# EAGLE design Crowtail- A6 GPRS GSM Module v1.0 (EAGLE 6.3)
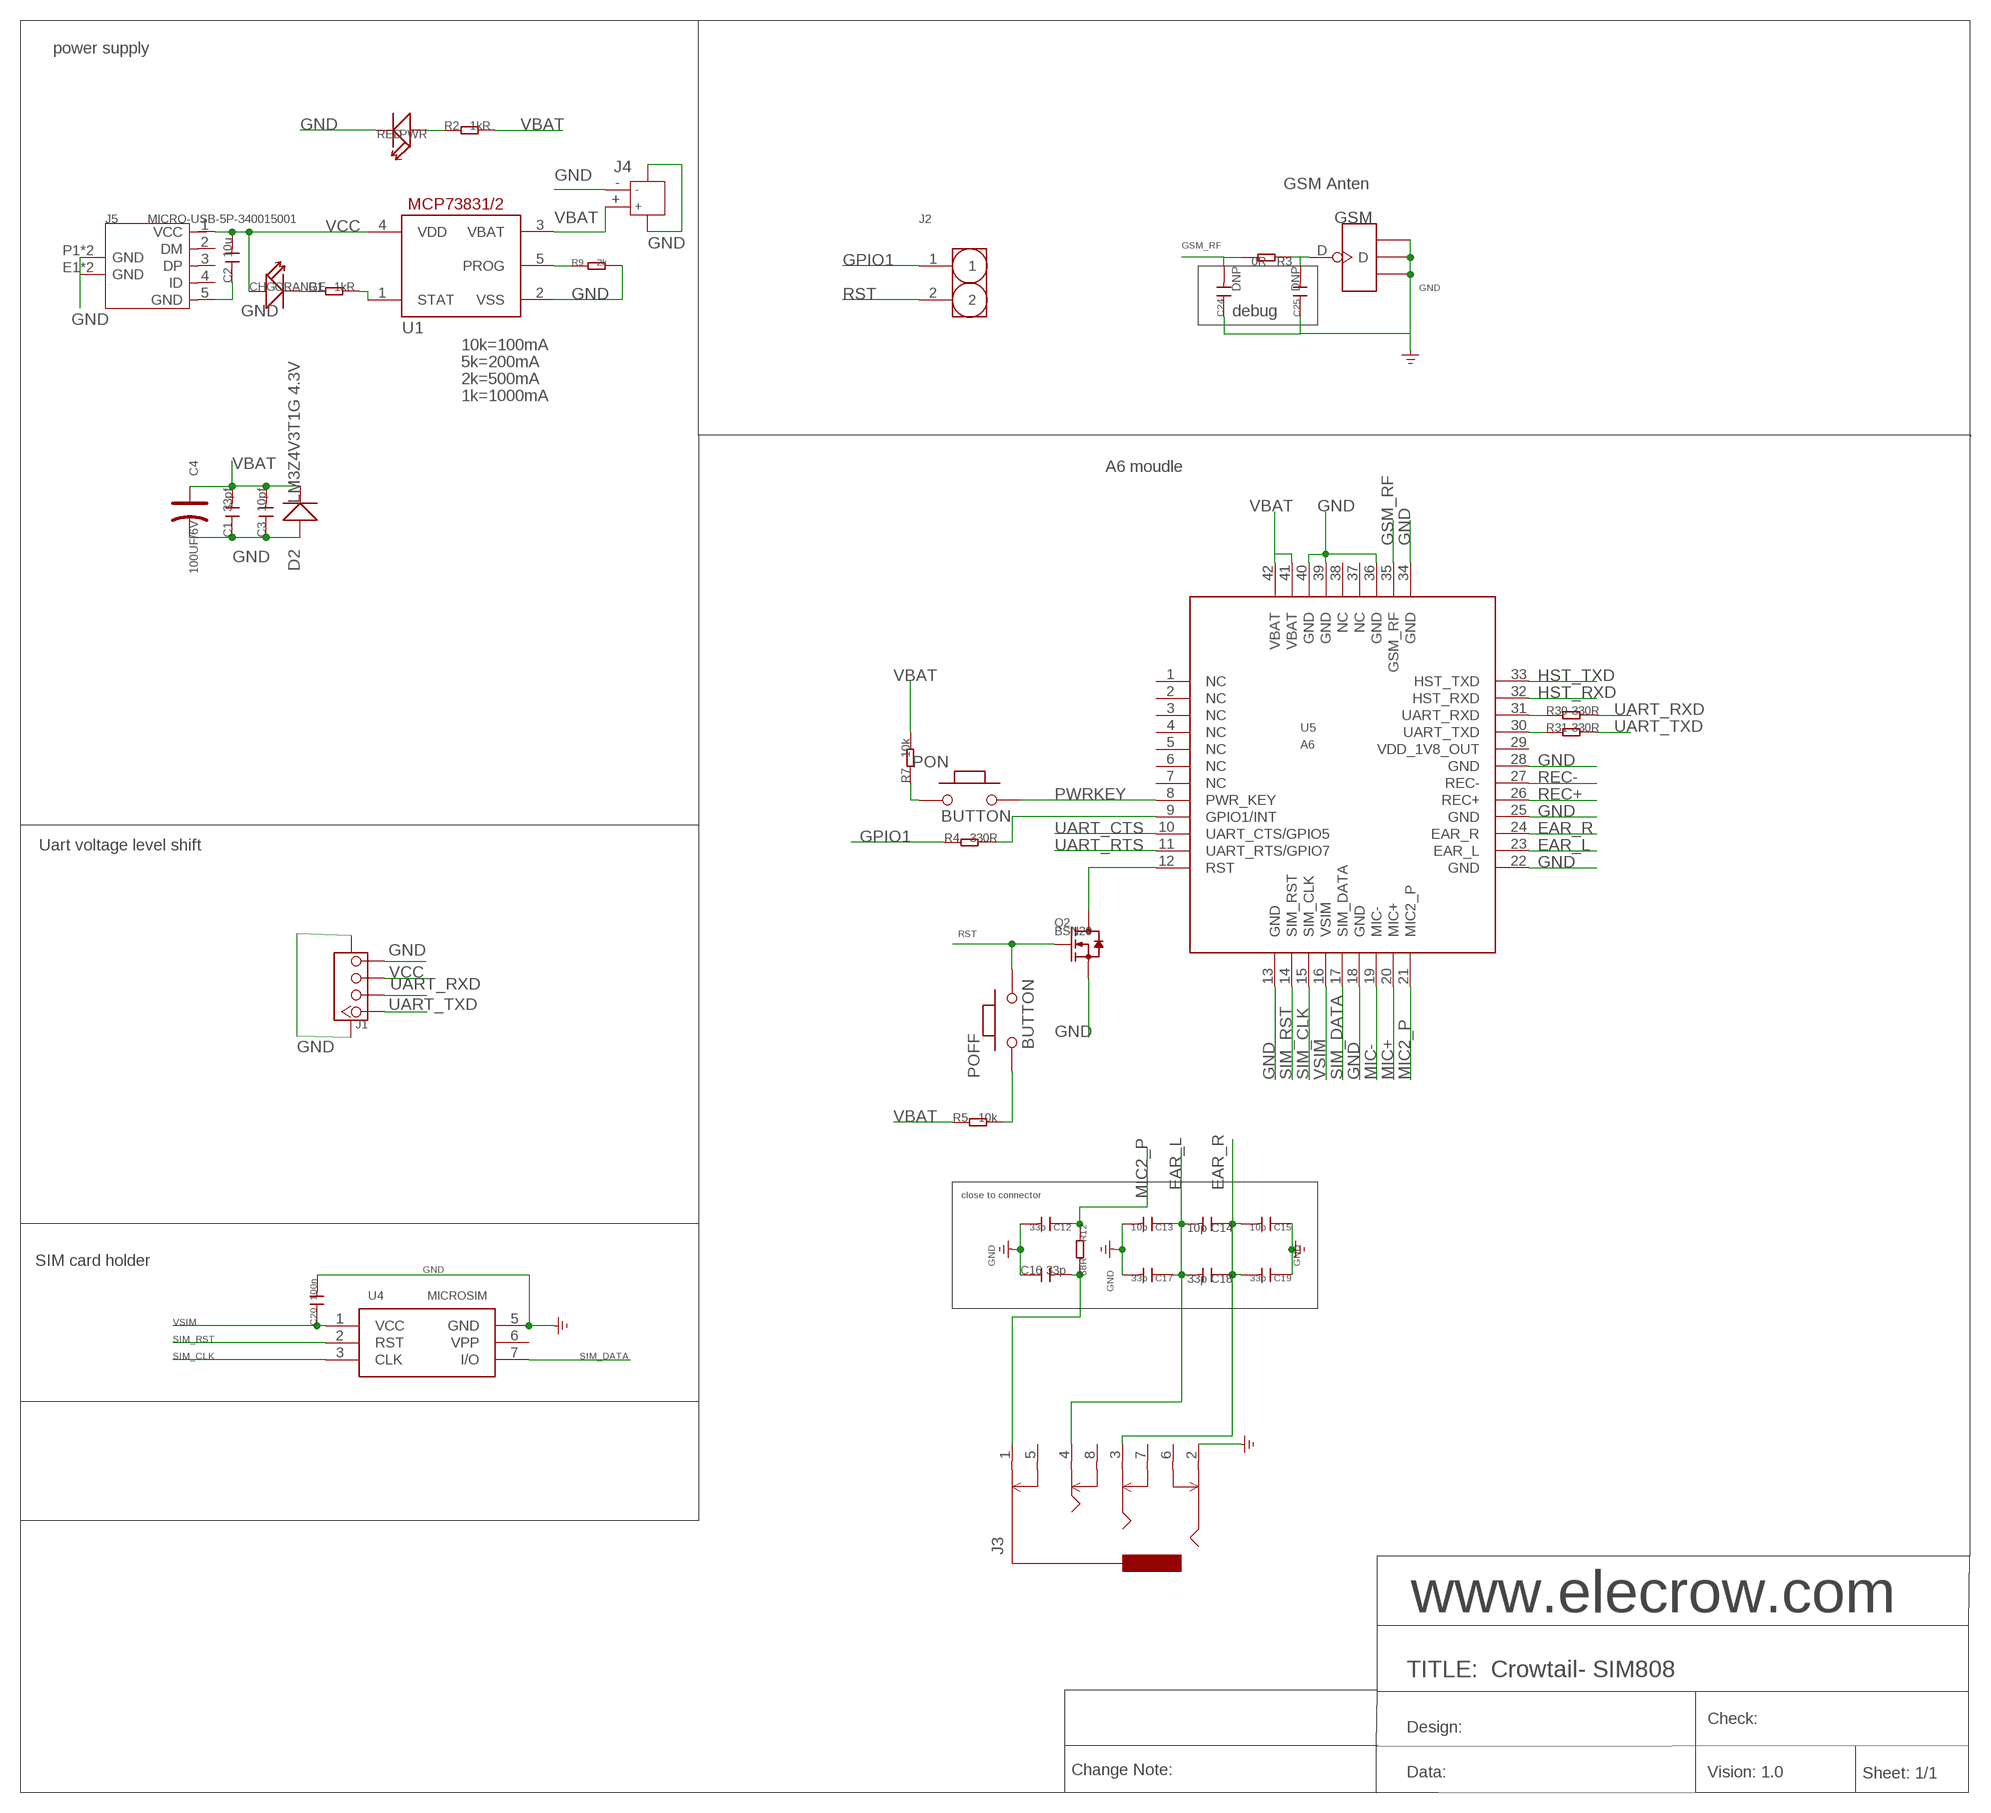
[diagram p0: schematic, sheet 1]

## Parts
C1  33pf  C-0603  [C0603]
C2  10u  C-0603  [C0603]
C3  10pf  C-0603  [C0603]
C4  100UF/6V  CAP-AVX-A  [AVX-A]
C12  33p  C-0603  [C0603]
C13  10p  C-0402  [C0402]
C14  10p  C-0402  [C0402]
C15  10p  C-0402  [C0402]
C16  33p  C-0603  [C0603]
C17  33p  C-0402  [C0402]
C18  33p  C-0402  [C0402]
C19  33p  C-0402  [C0402]
C20  100n  C-0603  [C0603]
C24  DNP  C-0402  [C0402]
C25  DNP  C-0402  [C0402]
CHG  ORANGE  007-LED0603  [D0603]
D2  LM3Z4V3T1G 4.3V  D'0805'  [SOD323]
GSM  ANTENNA-U-FL  [4P-U-FL]
J1  TWIG-4P-2.0-SMD-FEMALE-REINFORCE'90D'  [4P-SMD-2.0-90D]
J2  HEADER-2P-65/35MIL  [2P-2.54-65/35MIL]
J3  AUDIO-8P'PJ-3536-L6S'  [8P-3.5-SMD]
J4  JACK-JST-2P-SMD-PW'2.0'  [JST-SMD-2.0-90D]
J5  MICRO-USB-5P-340015001  [B-SMD-5P]
POFF  BUTTON  PB157  [157SW]
PON  BUTTON  PB157  [157SW]
PWR  RED  007-LED0603  [D0603]
Q2  BSN20  MOSFET-N'SOT23'  [SOT23]
R1  1kR  R-0603  [R0603]
R2  1kR  R-0603  [R0603]
R3  0R  R-0603  [R0603]
R4  330R  R-0603  [R0603]
R5  10k  R-0603  [R0603]
R7  10k  R-0603  [R0603]
R9  2k  R-0603  [R0603]
R12  68R  R-0603  [R0603]
R30  330R  R-0603  [R0603]
R31  330R  R-0603  [R0603]
U1  MCP73831/OT  [SOT23-5L]
U4  MICROSIM  [MICROSIM]
U5  A6  [A6]

## Nets
EAR_L: C13.1 C14.2 C17.1 C18.2 J3.4 U5.23(EAR_L)
EAR_R: C14.1 C15.2 C18.1 C19.2 J3.3 U5.24(EAR_R)
GND: C1.1 C2.1 C3.1 C4.- C12.2 C13.2 C15.1 C16.1 C17.2 C19.1 C20.2 C24.1 C25.1 D2.+ GSM.GND1 GSM.GND2 GSM.GND3 J1.4 J1.SS1 J1.SS2 J3.2 J4.3 J4.4 J4.- J5.5(GND) J5.E1(GND) J5.E2(GND) J5.P1(GND) J5.P2(GND) PWR.- Q2.2(S) R9.2 U1.2(VSS) U4.5(GND) U5.13(GND) U5.18(GND) U5.22(GND) U5.25(GND) U5.28(GND) U5.34(GND) U5.36(GND) U5.39(GND) U5.40(GND)
GPIO1: J2.1 R4.1
GSM_RF: C24.2 R3.2 U5.35(GSM_RF)
HST_RXD: U5.32(HST_RXD)
HST_TXD: U5.33(HST_TXD)
MIC2_P: C12.1 R12.1 U5.21(MIC2_P)
MIC+: U5.20(MIC+)
MIC-: U5.19(MIC-)
N$1: POFF.1 R5.2
N$5: C25.2 GSM.D R3.1
N$6: PWR.+ R2.1
N$7: R30.1 U5.31(UART_RXD)
N$8: R31.1 U5.30(UART_TXD)
N$9: PON.1 R7.1
N$11: CHG.- R1.1
N$12: Q2.3(D) U5.12(RST)
N$13: R4.2 U5.9(GPIO1/INT)
N$20: R1.2 U1.1(STAT)
N$30: C16.2 J3.1 R12.2
N$31: R9.1 U1.5(PROG)
PWRKEY: PON.2 U5.8(PWR_KEY)
REC+: U5.26(REC+)
REC-: U5.27(REC-)
RST: J2.2 POFF.2 Q2.1(G)
SIM_CLK: U4.3(CLK) U5.15(SIM_CLK)
SIM_DATA: U4.7(I/O) U5.17(SIM_DATA)
SIM_RST: U4.2(RST) U5.14(SIM_RST)
UART_CTS: U5.10(UART_CTS/GPIO5)
UART_RTS: U5.11(UART_RTS/GPIO7)
UART_RXD: J1.2 R30.2
UART_TXD: J1.1 R31.2
VBAT: C1.2 C3.2 C4.+ D2.- J4.+ R2.2 R5.1 R7.2 U1.3(VBAT) U5.41(VBAT) U5.42(VBAT)
VCC: C2.2 CHG.+ J1.3 J5.1(VCC) U1.4(VDD)
VSIM: C20.1 U4.1(VCC) U5.16(VSIM)
Unconnected: J3.5 J3.6 J3.7 J3.8 J5.2(DM) J5.3(DP) J5.4(ID) U4.6(VPP) U5.1(NC) U5.2(NC) U5.3(NC) U5.4(NC) U5.5(NC) U5.6(NC) U5.7(NC) U5.29(VDD_1V8_OUT) U5.37(NC) U5.38(NC)

## Notes on the sheet
- power supply
- GSM Anten
- debug
- 10k=100mA
- 5k=200mA
- 2k=500mA
- 1k=1000mA
- A6 moudle
- Uart voltage level shift
- close to connector
- SIM card holder
- www.elecrow.com
- TITLE:  Crowtail- SIM808
- Check:
- Design:
- Change Note: | Data: | Vision: 1.0 | Sheet: 1/1

## Library data of the parts
C1-C3 C12-C20 C24 C25 = Discrete:C*: Ceramic Capacitors
C4 = Discrete:CAP*: Electrolytic Capacitors,Tantalum Capacitors and Super Capacitors
CHG PWR = Discrete:007-LED*
D2 = Discrete:D*
GSM = Connector:ANTENNA-U-FL
J1 = Connector:TWIG-4P-2.0-SMD-FEMALE-REINFORCE
J2 = Connector:HEADER-2P
J3 = template:AUDIO-8P
J4 = Connector:JACK-JST-2P-SMD-PW
J5 = OPL Eagle Library:MICRO-USB-5P: ST-USB-001E：MICRO USB B SMD R/A
POFF PON = MySMD:PB157
Q2 = Discrete:MOSFET-N: IRLL014: http://www.vishay.com/docs/91319/sihll014.pdf
R1-R5 R7 R9 R12 R30 R31 = Discrete:R*
U1 = adafruit:MCP73831: MCP73831/2 Miniature Single-Cell, Fully Integrated Li-Ion, Li-Polymer Charge Management Controllers. Nice and small simple lipoly charge controller, with adjustable current and status output (LED) http://www.ladyada.net/library/pcb/eaglelibrary.html
U4 = Connector:MICROSIM
U5 = IC:A6

## Net classes
0 default: width 0.152 mm, drill 0.152 mm, clearance 0.152 mm

## Board
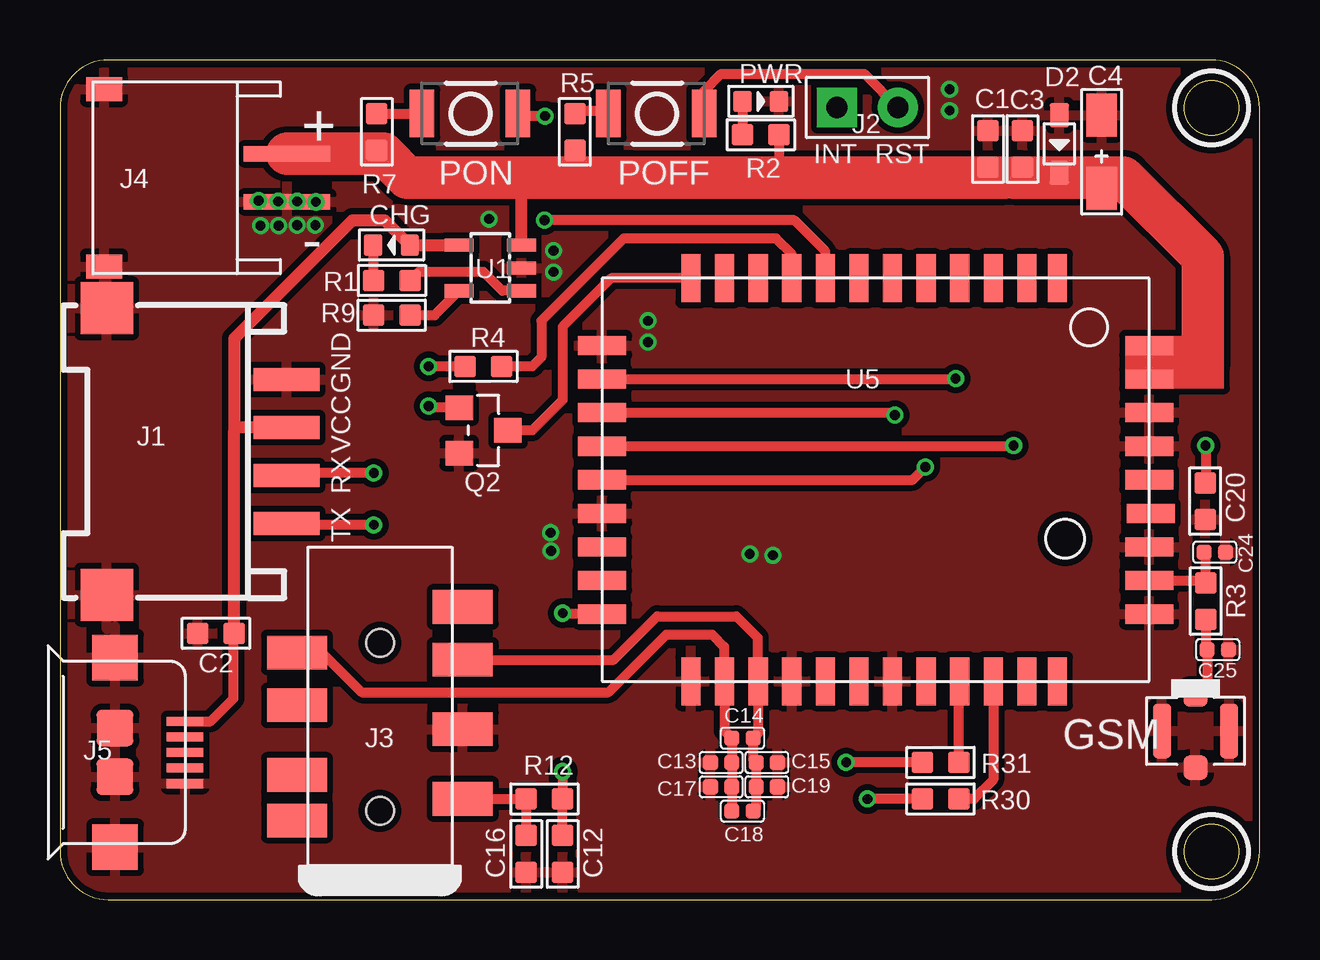
[diagram p1: board, top side]
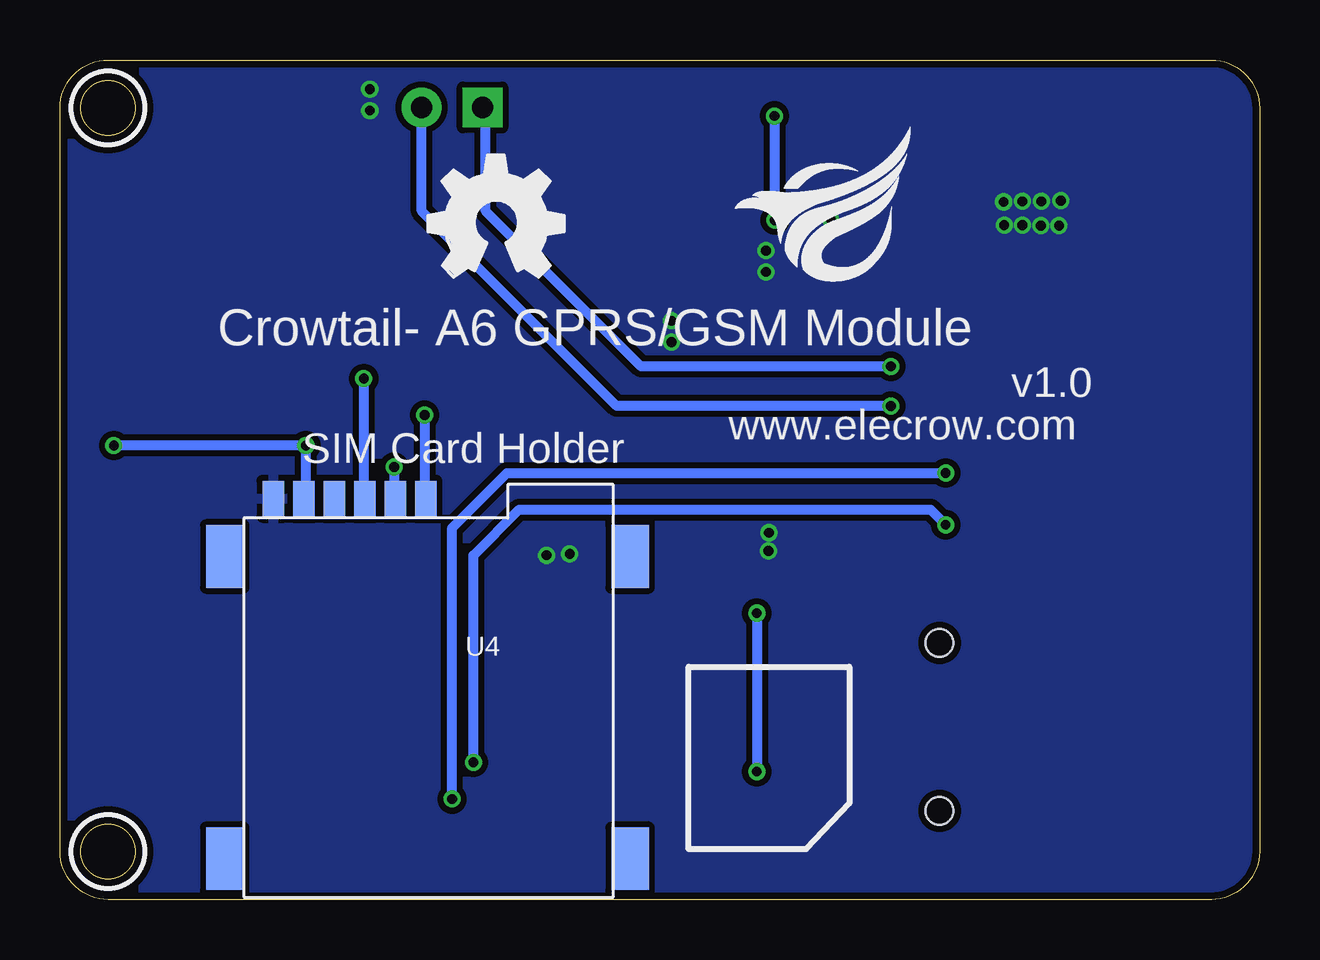
[diagram p2: board, bottom side, seen from below]

Size 50 x 35 mm. Coordinates in mm from the lower left corner, seen from the top.
Outline: 0,33 0,2 arc90 2,0 48,0 arc90 50,2 50,33 arc90 48,35 2,35 arc90 0,33
Outline: circle at 48,2 radius 1.14
Outline: circle at 48,33 radius 1.14
Copper layers (1*16): Top 0.035mm / dielectric 1.5mm / Bottom 0.035mm
Design rules "default": minimum track width 6mil, minimum drill 12mil, track to track 10mil, track to pad 10mil, pad to pad 10mil, via to via 6mil, smd to smd 0mil, copper to edge 12mil, drill to drill 12mil, minimum pad ring 10mil, minimum via ring 6mil, stop-mask expansion 2mil, vias tented up to drill 100mil, thermal gap 10mil
tRestrict: area 35.6,41.9 to 35.7,43.3; area 46.5,0.5 to 49.5,3.5; area 46.5,31.5 to 49.5,34.5
bRestrict: area 46.5,0.5 to 49.5,3.5; area 46.5,31.5 to 49.5,34.5

### Footprints (pad centres in the part's own frame; a part is rotated, then mirrored left to right if it is on the bottom)
C0603 = smd 0.889 x 0.889: 1 -0.762,0; 2 0.762,0
AVX-A = smd 1.778 x 1.27: + -1.524,0; - 1.524,0
C0402 = smd 0.635 x 0.635: 1 -0.445,0; 2 0.445,0
D0603 = smd 0.762 x 0.889: + -0.762,0; - 0.762,0
SOD323 = smd 1 x 0.8: + -1.2,0; - 1.2,0
4P-U-FL = smd 1.016 x 1.016: D -1.524,0; GND3 1.524,0 | smd 2.286 x 0.762: GND1 0,1.397; GND2 0,-1.397
4P-SMD-2.0-90D = smd 0.965 x 2.74: 1 -3,-0.1; 2 -1,-0.1; 3 1,-0.1; 4 3,-0.1 | smd 2.159 x 2.184: SS1 -5.974,7.4; SS2 5.974,7.4
2P-2.54-65/35MIL = drill 0.889 pad 1.651 square: 1 0,1.27 | drill 0.889 pad 1.651: 2 0,-1.27
8P-3.5-SMD = smd 1.4 x 2.5: 1 2.8,-3.45; 2 5.7,-3.45; 3 8.6,-3.45; 4 8.9,3.45; 5 1.9,3.45; 6 3.8,3.45; 7 6.7,3.45; 8 10.8,-3.45 | hole 1.149: 2.3,0; 9.3,0
JST-SMD-2.0-90D = smd 1 x 1.5: 3 3.7,-2.54; 4 -3.7,-2.54 | smd 0.635 x 3.6: + -1,5.08; - 1,5.08
B-SMD-5P = smd 0.38 x 1.52: 1 -1.3,2.54; 2 -0.65,2.54; 3 0,2.54; 4 0.65,2.54; 5 1.3,2.54 | smd 1.524 x 1.524: E1 -1.016,-0.381; E2 1.016,-0.381 | smd 1.9 x 1.9: P1 -3.95,-0.381; P2 3.95,-0.381
157SW = smd 1.016 x 1.981: 1 0,0; 2 4,0
SOT23 = smd 1.016 x 1.143: 1 -0.95,-1.016; 2 0.95,-1.016; 3 0,1.016
R0603 = smd 0.889 x 0.889: 1 -0.762,0; 2 0.762,0
SOT23-5L = smd 0.55 x 1.2: 1 -0.95,-1.3; 2 0,-1.3; 3 0.95,-1.3; 4 0.95,1.3; 5 -0.95,1.3
MICROSIM = smd 1.5 x 0.9: 1 -0.8,2.5; 2 -0.8,5.04; 3 -0.8,7.58; 5 -0.8,1.23; 6 -0.8,3.77; 7 -0.8,6.31 | smd 2.61 x 1.56: P$1 1.6,-0.8; P$2 14.2,-0.8; P$3 14.2,16.1; P$4 1.6,16.1
A6 = smd 0.8 x 2: 1 7.57,8.4; 2 6.3,8.4; 3 4.9,8.4; 4 3.5,8.4; 5 2.1,8.4; 6 0.7,8.4; 7 -0.7,8.4; 8 -2.1,8.4; 9 -3.5,8.4; 10 -4.9,8.4; 11 -6.3,8.4; 12 -7.7,8.4; 22 -7.7,-8.4; 23 -6.3,-8.4; 24 -4.9,-8.4; 25 -3.5,-8.4; 26 -2.1,-8.4; 27 -0.7,-8.4; 28 0.7,-8.4; 29 2.1,-8.4; 30 3.5,-8.4; 31 4.9,-8.4; 32 6.3,-8.4; 33 7.57,-8.4 | smd 2 x 0.8: 13 -11.4,5.6; 14 -11.4,4.2; 15 -11.4,2.8; 16 -11.4,1.4; 17 -11.4,0; 18 -11.4,-1.4; 19 -11.4,-2.8; 20 -11.4,-4.2; 21 -11.4,-5.6; 34 11.4,-5.6; 35 11.4,-4.2; 36 11.4,-2.8; 37 11.46,-1.4; 38 11.4,0; 39 11.4,1.4; 40 11.4,2.8; 41 11.4,4.2; 42 11.4,5.6

### Placement (x,y rotation side)
C1  38.68,31.29 270 top
C2  6.5,11.1 0 top
C3  40.12,31.29 270 top
C4  43.42,31.17 90 top
C12  20.95,1.91 270 top
C13  27.56,5.71 180 top
C14  28.45,6.73 180 top
C15  29.46,5.71 180 top
C16  19.43,1.91 90 top
C17  27.56,4.7 180 top
C18  28.45,3.68 180 top
C19  29.46,4.7 180 top
C20  47.73,16.61 270 top
C24  48.13,14.48 180 top
C25  48.26,10.41 180 top
CHG  13.82,27.28 180 top
D2  41.66,31.5 270 top
GSM  47.33,7.03 270 top
J1  9.35,18.68 90 top
J2  33.66,33.02 90 top
J3  13.34,1.4 90 top
J4  4.38,30.09 270 top
J5  2.67,6.13 270 top
LOGO2  LOGO-OSHW-FILLX0200-NT  [OSHW_FILLX200_NOTEXT]  34.66,25.94 0 bottom
POFF  22.86,32.77 0 top
PON  15.09,32.77 0 top
PWR  29.21,33.27 0 top
Q2  17.65,19.56 270 top
R1  13.84,25.81 0 top
R2  29.21,31.88 0 top
R3  47.75,12.45 90 top
R4  17.65,22.23 0 top
R5  21.46,32 90 top
R7  13.21,32 270 top
R9  13.83,24.36 180 top
R12  20.19,4.19 180 top
R30  36.7,4.19 180 top
R31  36.7,5.71 180 top
U1  17.94,26.33 90 top
U4  42.33,15.9 270 bottom
U5  34,17.5 0 top
U$4  [ELECROW_NRW_6]  21.86,25.77 0 bottom

### Tracks (layer width: path | path; a pad name or v marks a point on that pad's centre or on a via)
EAR_L
  Top 0.406: C18.2 C17.1 C13.1 C14.2 27.7,7.04 U5.23 27.69,9.11 27.69,10.54 27.18,11.05 25.27,11.05 22.86,8.64 12.57,8.64 10.91,10.3 J3.4
EAR_R
  Top 0.406: C18.1 29.02,3.81 C19.2 C15.2 28.89,5.84 C14.1 29.1,6.94 U5.24 29.08,9.12 29.08,10.92 28.19,11.81 24.89,11.81 23.08,10 J3.3
GND  (via drill 0.41)
  other vias: 29.72,14.35 24.51,23.24 24.51,24.13 20.57,27.05 20.57,26.16 28.75,14.4 20.45,15.29 20.47,14.53 8.36,28.09 8.28,29.13 9.09,29.11 9.88,29.11 10.67,29.08 9.12,28.09 9.88,28.12 10.64,28.12 17.88,28.37 37.08,33.78 37.08,32.89
  pour Bottom (isolate 0.254): -1.27,-1.27 50.8,-1.27 50.8,35.56 -1.27,35.56
  pour Top (isolate 0.254): -1.27,-1.27 50.8,-1.27 50.8,35.56 -1.27,35.56
GPIO1  (via drill 0.41)
  Top 0.406: R4.1 v15.37,22.23
  Bottom 0.406: v15.37,22.23 25.78,22.23 32.26,28.7 32.26,32.89 J2.1
GSM_RF
  Top 0.406: U5.35 47.66,13.3 R3.2 47.75,14.41 C24.2
MIC2_P  (via drill 0.41)
  Top 0.406: C12.1 R12.1 v20.95,5.33 | U5.21 20.99,11.9 v20.95,11.94
  Bottom 0.406: v20.95,11.94 v20.95,5.33
N$1
  Top 0.406: R5.2 21.59,32.89 22.73,32.89 POFF.1
N$5
  Top 0.406: R3.1 47.75,10.48 C25.2 47.82,9.03 arc-90 GSM.D
N$6
  Top 0.406: PWR.+ R2.1
N$7
  Top 0.406: U5.31 38.9,4.99 38.1,4.19 R30.1
N$8
  Top 0.406: R31.1 37.47,9.06 U5.30
N$9
  Top 0.406: R7.1 PON.1
N$11
  Top 0.406: CHG.- 13.05,25.83 R1.1
N$12
  Top 0.406: U5.12 22.98,25.9 20.95,23.88 20.95,20.83 19.68,19.56 Q2.3
N$13
  Top 0.406: U5.9 30.5,26.9 29.84,27.56 23.5,27.56 20.07,24.13 20.07,22.61 19.68,22.23 R4.2
N$20
  Top 0.406: U1.1 18.44,25.38 17.65,26.16 14.95,26.16 R1.2
N$30
  Top 0.406: C16.2 R12.2 J3.1
N$31
  Top 0.406: R9.1 15.62,24.36 U1.5
PWRKEY  (via drill 0.41)
  Top 0.406: U5.8 31.9,27.03 30.61,28.32 v20.19,28.32 | v20.22,32.66 19.19,32.66 PON.2
  Bottom 0.406: v20.19,28.32 20.19,32.64 v20.22,32.66
RST  (via drill 0.41)
  Top 0.406: Q2.1 15.43,20.51 v15.37,20.57 | POFF.2 26.86,33.72 27.56,34.42 33.53,34.42 J2.2
  Bottom 0.406: v15.37,20.57 26.8,20.57 34.92,28.7 J2.2
SIM_CLK  (via drill 0.41)
  Top 0.406: U5.15 34.69,20.3 v34.8,20.19
  Bottom 0.406: v34.8,20.19 34.8,16.75 U4.3
SIM_DATA  (via drill 0.41)
  Top 0.406: U5.17 35.53,17.5 v36.07,18.03
  Bottom 0.406: v36.07,18.03 36.07,16.75 U4.7
SIM_RST  (via drill 0.41)
  Top 0.406: U5.14 37.32,21.7 v37.34,21.72
  Bottom 0.406: v37.34,21.72 37.34,16.75 U4.2
UART_RXD  (via drill 0.41)
  Top 0.406: R30.2 v33.66,4.19 | v13.08,17.78 9.55,17.78 J1.2
  Bottom 0.406: v33.66,4.19 33.66,15.49 31.37,17.78 v13.08,17.78
UART_TXD  (via drill 0.41)
  Top 0.406: R31.2 v32.77,5.71 | v13.08,15.62 9.51,15.62 J1.1
  Bottom 0.406: v32.77,5.71 32.77,14.35 30.86,16.26 13.72,16.26 v13.08,15.62
VBAT
  Top 0.406: 19.24,30.04 19.18,30.1 | 23.5,30.35 23.75,30.1 | R7.2 13.21,31.21 13.34,31.09 | C1.2 38.94,30.53 39.37,30.1 | 39.74,30.11 39.75,30.1 | 40.54,30.1 40.01,30.1 40.12,30.21 C3.2 | 44.32,30.1 43.87,30.1 C4.+ | 47.62,22.23 45.92,22.23 U5.41 U5.42 | D2.- 41.22,30.3 41.02,30.1 | R2.2 29.97,30.1 | R5.1 21.46,30.1
  Top 0.508: U1.3 19.24,30.04
  Top 1.676: 13.34,31.09 13.49,31.09 | 39.37,30.1 39.75,30.1
  Top 1.778: J4.+ 13.34,31.09 | 13.49,31.09 14.48,30.1 19.18,30.1 21.46,30.1 23.75,30.1 29.97,30.1 39.37,30.1 | 39.75,30.1 40.01,30.1 41.02,30.1 44.32,30.1 47.62,26.8 47.62,22.23
VCC
  Top 0.406: J5.1 6.29,7.43 7.24,8.38 7.24,11.08 C2.2
  Top 0.508: C2.2 7.26,19.56 | U1.4 CHG.+ 13.54,28.32 12.19,28.32 7.26,23.39 7.26,19.56 | J1.3 7.38,19.68 7.26,19.56
VSIM  (via drill 0.41)
  Top 0.406: 47.78,17.41 C20.1 47.75,17.39 v47.75,18.92 | U5.16 39.73,18.9 v39.75,18.92
  Bottom 0.406: U4.1 39.75,16.79 v39.75,18.92 v47.75,18.92
(copper drawn outside any net)
  shapes: Top area x1

### Text on the board
tPlace: + | INT | RST | - | GND | VCC | RX | TX
bPlace: Crowtail- A6 GPRS/GSM Module | v1.0 | www.elecrow.com | SIM Card Holder